# Altium schematic sheet Page I_B2B_B.SchDoc
size 386 x 246 mm; SheetNumber: 0; SheetTotal: 0
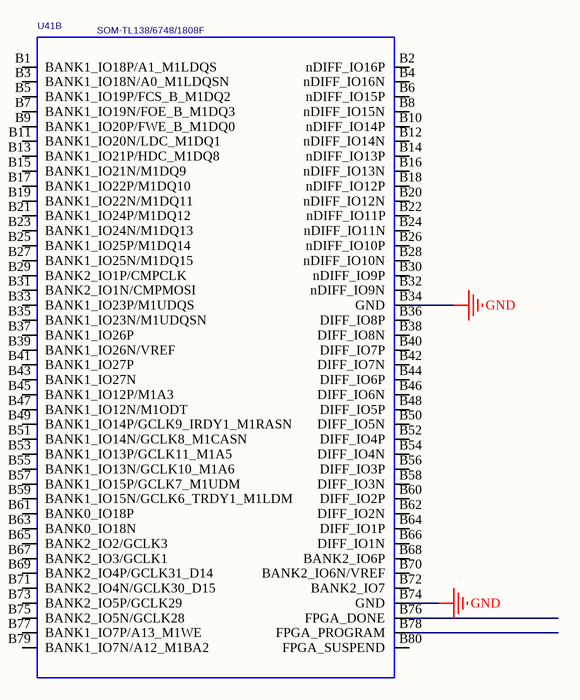
[diagram p0: Page I_B2B_B.SchDoc]

## Parts
U41  SOM-TL138/6748/1808F  [TL138_6748_1808F]  (part B of 5)

## Nets
GND: U41.B34(GND) U41.B74(GND)

Not connected (* = marked no-connect by the designer): U41 B1(BANK1_IO18P/A1_M1LDQS) B2(nDIFF_IO16P) B3(BANK1_IO18N/A0_M1LDQSN) B4(nDIFF_IO16N) B5(BANK1_IO19P/FCS_B_M1DQ2) B6(nDIFF_IO15P) B7(BANK1_IO19N/FOE_B_M1DQ3) B8(nDIFF_IO15N) B9(BANK1_IO20P/FWE_B_M1DQ0) B10(nDIFF_IO14P) B11(BANK1_IO20N/LDC_M1DQ1) B12(nDIFF_IO14N) B13(BANK1_IO21P/HDC_M1DQ8) B14(nDIFF_IO13P) B15(BANK1_IO21N/M1DQ9) B16(nDIFF_IO13N) B17(BANK1_IO22P/M1DQ10) B18(nDIFF_IO12P) B19(BANK1_IO22N/M1DQ11) B20(nDIFF_IO12N) B21(BANK1_IO24P/M1DQ12) B22(nDIFF_IO11P) B23(BANK1_IO24N/M1DQ13) B24(nDIFF_IO11N) B25(BANK1_IO25P/M1DQ14) B26(nDIFF_IO10P) B27(BANK1_IO25N/M1DQ15) B28(nDIFF_IO10N) B29(BANK2_IO1P/CMPCLK) B30(nDIFF_IO9P) B31(BANK2_IO1N/CMPMOSI) B32(nDIFF_IO9N) B33(BANK1_IO23P/M1UDQS) B35(BANK1_IO23N/M1UDQSN) B36(DIFF_IO8P) B37(BANK1_IO26P) B38(DIFF_IO8N) B39(BANK1_IO26N/VREF) B40(DIFF_IO7P) B41(BANK1_IO27P) B42(DIFF_IO7N) B43(BANK1_IO27N) B44(DIFF_IO6P) B45(BANK1_IO12P/M1A3) B46(DIFF_IO6N) B47(BANK1_IO12N/M1ODT) B48(DIFF_IO5P) B49(BANK1_IO14P/GCLK9_IRDY1_M1RASN) B50(DIFF_IO5N) B51(BANK1_IO14N/GCLK8_M1CASN) B52(DIFF_IO4P) B53(BANK1_IO13P/GCLK11_M1A5) B54(DIFF_IO4N) B55(BANK1_IO13N/GCLK10_M1A6) B56(DIFF_IO3P) B57(BANK1_IO15P/GCLK7_M1UDM) B58(DIFF_IO3N) B59(BANK1_IO15N/GCLK6_TRDY1_M1LDM) B60(DIFF_IO2P) B61(BANK0_IO18P) B62(DIFF_IO2N) B63(BANK0_IO18N) B64(DIFF_IO1P) B65(BANK2_IO2/GCLK3) B66(DIFF_IO1N) B67(BANK2_IO3/GCLK1) B68(BANK2_IO6P) B69(BANK2_IO4P/GCLK31_D14) B70(BANK2_IO6N/VREF) B71(BANK2_IO4N/GCLK30_D15) B72(BANK2_IO7) B73(BANK2_IO5P/GCLK29) B75(BANK2_IO5N/GCLK28) B76(FPGA_DONE) B77(BANK1_IO7P/A13_M1WE) B78(FPGA_PROGRAM) B79(BANK1_IO7N/A12_M1BA2) B80(FPGA_SUSPEND)

## Library data of the parts
U41 = TL_4: Manufacturer: TL; Remark: 三核核心板; Manufacturer PartNumber: SOM-TL138/6748/1808F